# Altium project Telemetry_2.PrjPcb
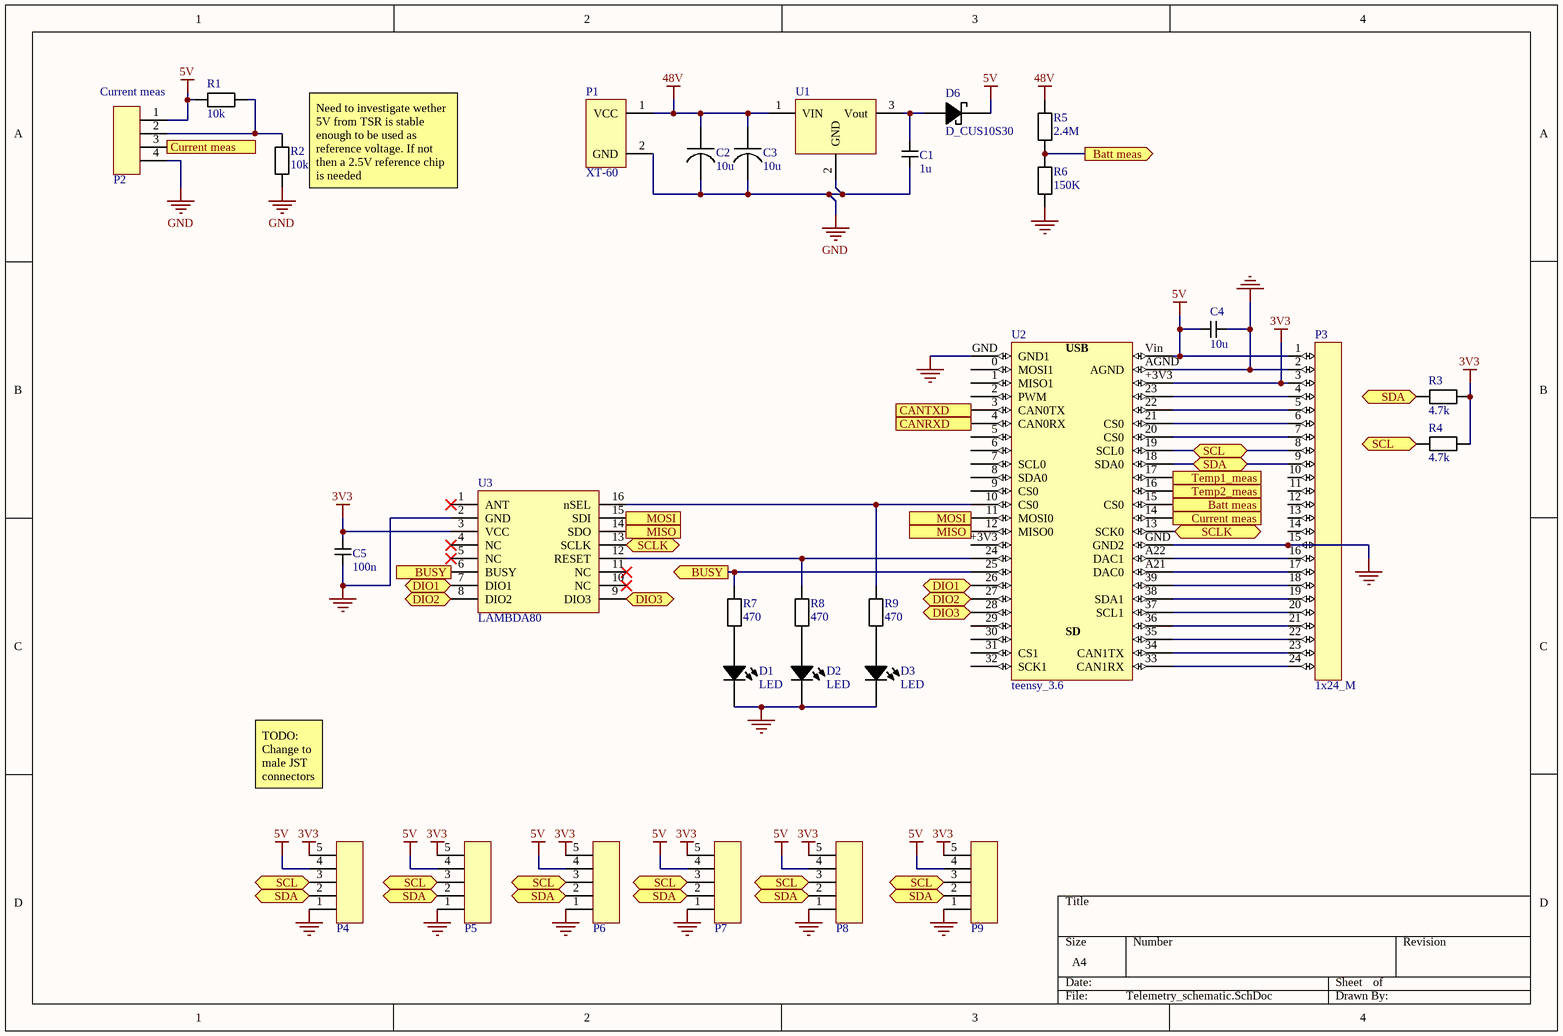
[diagram p0: Telemetry_schematic.SchDoc]
3 sheets, 55 parts. Net scope: flat (ports and power ports of the same name join across sheets).
Board file: Telemetry_PCB_2.PcbDoc
Sheets:
  Telemetry_schematic.SchDoc
  Telemetry_canbus.SchDoc
  Telemetry_temp_meas.SchDoc

## Sheet Telemetry_schematic.SchDoc: oiaejrboidr
size A4; Revision: 1.1; SheetNumber: 1; SheetTotal: 1

### Parts
C1  value 1u  [C_SMD_0805_pcb]  (hidden comment: SMD)
C2  value 10u  [C_EL_SMT_Ø6.3]  (hidden comment: C_EL_SMT_Ø6.3)
C3  value 10u  [C_EL_SMT_Ø6.3]  (hidden comment: C_EL_SMT_Ø6.3)
C4  value 10u  [C_SMD_0805_pcb]  (hidden comment: SMD)
C5  value 100n  [C_SMD_0805_pcb]  (hidden comment: SMD)
D1  LED  [D_LED_0805]
D2  LED  [D_LED_0805]
D3  LED  [D_LED_0805]
D6  D_CUS10S30  [D_SC-76]
P1  XT-60  [XT-60]
P2  JST_SE_4PIN  [JST_SE_4PIN]  (value not drawn)
P3  1x24_M  [PIN_HEADER_M_1x24]
P4  1x5_M  [PIN_HEADER_M_1x5]  (value not drawn)
P5  1x5_M  [PIN_HEADER_M_1x5]  (value not drawn)
P6  1x5_M  [PIN_HEADER_M_1x5]  (value not drawn)
P7  1x5_M  [PIN_HEADER_M_1x5]  (value not drawn)
P8  1x5_M  [PIN_HEADER_M_1x5]  (value not drawn)
P9  1x5_M  [PIN_HEADER_M_1x5]  (value not drawn)
R1  value 10k  [R_SMD_0805_pcb]  (hidden comment: SMD)
R2  value 10k  [R_SMD_0805_pcb]  (hidden comment: SMD)
R3  value 4.7k  [R_SMD_0805_pcb]  (hidden comment: SMD)
R4  value 4.7k  [R_SMD_0805_pcb]  (hidden comment: SMD)
R5  value 2.4M  [R_SMD_0805_pcb]  (hidden comment: SMD)
R6  value 150K  [R_SMD_0805_pcb]  (hidden comment: SMD)
R7  value 470  [R_SMD_0805_pcb]  (hidden comment: SMD)
R8  value 470  [R_SMD_0805_pcb]  (hidden comment: SMD)
R9  value 470  [R_SMD_0805_pcb]  (hidden comment: SMD)
U1  TSR_0.6-4850WI  [TSR_0.6-4850WI]  (value not drawn)
U2  teensy_3.6  [teensy_3.6]
U3  LAMBDA80  [LAMBDA62_SMT]

### Ports
Batt meas (in), Batt meas (out), BUSY (in), BUSY (out), CANRXD (out), CANTXD (in), Current meas (in), Current meas (out), DIO1 (bidir), DIO2 (bidir), DIO3 (bidir), MISO (in), MISO (out), MOSI (in), MOSI (out), SCL (bidir), SCLK (bidir), SDA (bidir), Temp1_meas (in), Temp2_meas (in)

### Nets
3V3: C5.1 P3.3 P4.5 P5.5 P6.5 P7.5 P8.5 P9.5 R3.1 R4.1 U2.+3V3 U3.3(VCC)
5V: C4.2 D6.2 P2.1 P3.1 P4.4 P5.4 P6.4 P7.4 P8.4 P9.4 R1.1 U2.Vin
48V: C2.2 C3.2 P1.1(VCC) R5.2 U1.1(VIN)
GND: C1.2 C2.1 C3.1 C4.1 C5.2 D1.2 D2.2 D3.2 P1.2(GND) P2.4 P3.2 P3.15 P4.1 P5.1 P6.1 P7.1 P8.1 P9.1 R2.1 R6.1 U1.2(GND) U2.AGND U2.GND(GND1) U3.2(GND)
NetC1_1: C1.1 D6.1 U1.3(Vout)
NetD1_1: D1.1 R7.1
NetD2_1: D2.1 R8.1
NetD3_1: D3.1 R9.1
NetP2_2: P2.2 R1.2 R2.2
NetP2_3: P2.3 U2.14 ; port Current meas
NetP3_4: P3.4 U2.23
NetP3_5: P3.5 U2.22
NetP3_6: P3.6 U2.21(CS0)
NetP3_7: P3.7 U2.20(CS0)
NetP3_8: P3.8 P4.3 P5.3 P6.3 P7.3 P8.3 P9.3 R4.2 U2.19(SCL0) ; port SCL
NetP3_9: P3.9 P4.2 P5.2 P6.2 P7.2 P8.2 P9.2 R3.2 U2.18(SDA0) ; port SDA
NetP3_16: P3.16 U2.A22(DAC1)
NetP3_17: P3.17 U2.A21(DAC0)
NetP3_18: P3.18 U2.39
NetP3_19: P3.19 U2.38(SDA1)
NetP3_20: P3.20 U2.37(SCL1)
NetP3_21: P3.21 U2.36
NetP3_22: P3.22 U2.35
NetP3_23: P3.23 U2.34(CAN1TX)
NetP3_24: P3.24 U2.33(CAN1RX)
NetR5_1: R5.1 R6.2 U2.15(CS0) ; port Batt meas
NetR7_2: R7.2 U2.25 U3.6(BUSY) ; port BUSY
NetR8_2: R8.2 U2.24 U3.12(RESET)
NetR9_2: R9.2 U2.10(CS0) U3.16(nSEL)
NetR12_1: U2.4(CAN0RX) ; port CANRXD
NetR13_1: U2.3(CAN0TX) ; port CANTXD
NetR16_2: U2.17 ; port Temp1_meas
NetR22_2: U2.16 ; port Temp2_meas
NetU2_11: U2.11(MOSI0) U3.15(SDI) ; port MOSI
NetU2_12: U2.12(MISO0) U3.14(SDO) ; port MISO
NetU2_13: U2.13(SCK0) U3.13(SCLK) ; port SCLK
NetU2_26: U2.26 U3.7(DIO1) ; port DIO1
NetU2_27: U2.27 U3.8(DIO2) ; port DIO2
NetU2_28: U2.28 U3.9(DIO3) ; port DIO3

Not connected (* = marked no-connect by the designer): P3 10 11 12 13 14; U2 0(MOSI1) 1(MISO1) 2(PWM) 5 6 7(SCL0) 8(SDA0) 9(CS0) 29 30 31(CS1) 32(SCK1); U3 1(ANT)* 4(NC)* 5(NC)* 10(NC)* 11(NC)*

### Notes on the sheet
- (near P2) Current meas
- (near R2) Need to investigate wether 5V from TSR is stable enough to be used as reference voltage. If not then a 2.5V reference chip is needed
- TODO: Change to male JST connectors
- (in symbol teensy_3.6) USB; SD

### Library data of the parts
C1 C4 C5 = C_SMD_0805: Supplier 1: *; Supplier Part Number 1: *
D1-D3 = D_LED_0805_SMD
D6 = D_CUS10S30: Schottky diode, 30V reverse voltage. 220mV forward drop @1A; Supplier Part Number 1: CUS10S30H3FCT-ND; Supplier Link 1: https://www.digikey.no/product-detail/en/toshiba-semiconductor-and-storage/CUS10S30H3F/CUS10S30H3FCT-ND/5114377
P3 = PIN_HEADER_M_1x24: Supplier Part Number 1: *; Supplier 1: *
P4-P9 = PIN_HEADER_M_1x5: Supplier Part Number 1: *; Supplier 1: *
R1-R9 = R_SMD_0805: Supplier 1: *; Supplier Part Number 1: *
U3 = LAMBDA_80_DIP
C2 C3 = C_EL_SMT_Ø6.3: Supplier 1: *; Supplier Part Number 1: *
P1 = XT-60: Supplier Part Number 1: *; Supplier 1: *
P2 = JST_SE_4PIN: Supplier Link 1: https://www.digikey.com/product-detail/en/jst-sales-america-inc/S4B-XH-A-LF-SN/455-2243-ND/1651041; Supplier Part Number 1: 455-2243-ND
U2 = teensy_3.6: Supplier 1: *; Supplier Part Number 1: *

## Sheet Telemetry_canbus.SchDoc: Telemetry CANbus
size A4; Organization: Altium Limited; Address1: L3, 12a Rodborough Rd; Address2: Frenchs Forest; Address3: NSW; Address4: Australia 2086; SheetNumber: 2; SheetTotal: 2
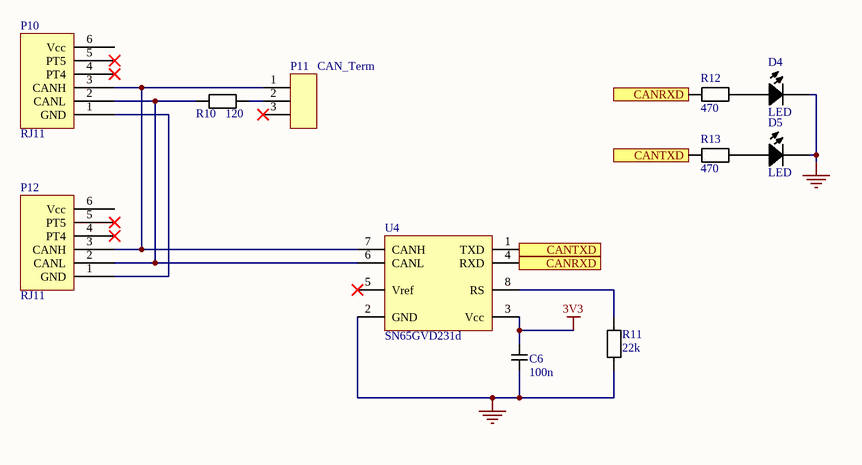
[diagram p1: Telemetry_canbus.SchDoc]

### Parts
C6  value 100n  [C_SMD_0805_pcb]  (hidden comment: SMD)
D4  LED  [D_LED_0805]
D5  LED  [D_LED_0805]
P10  RJ11  [RJ11_Connector]
P11  CAN_Term  [PIN_HEADER_M_1x3]
P12  RJ11  [RJ11_Connector]
R10  value 120  [R_SMD_0805_pcb]  (hidden comment: SMD)
R11  value 22k  [R_SMD_0805_pcb]  (hidden comment: SMD)
R12  value 470  [R_SMD_0805_pcb]  (hidden comment: SMD)
R13  value 470  [R_SMD_0805_pcb]  (hidden comment: SMD)
U4  SN65GVD231d  [SN65HVD231D_SMD]

### Ports
CANRXD, CANRXD (in), CANTXD, CANTXD (out)

### Nets
3V3: C6.1 U4.3(Vcc)
GND: C6.2 D4.2 D5.2 R11.1 U4.2(GND)
NetD4_1: D4.1 R12.2
NetD5_1: D5.1 R13.2
NetP10_1: P10.1(GND) P12.1(GND)
NetP10_2: P10.2(CANL) P12.2(CANL) R10.1 U4.6(CANL)
NetP10_3: P10.3(CANH) P11.1 P12.3(CANH) U4.7(CANH)
NetP11_2: P11.2 R10.2
NetR11_2: R11.2 U4.8(RS)
NetR12_1: R12.1 U4.4(RXD) ; port CANRXD
NetR13_1: R13.1 U4.1(TXD) ; port CANTXD

Not connected (* = marked no-connect by the designer): P10 4(PT4)* 5(PT5)* 6(Vcc); P11 3*; P12 4(PT4)* 5(PT5)* 6(Vcc); U4 5(Vref)*

### Notes on the sheet
- Title
- Size:
- Date:
- A4
- Number:
- Time:
- Revision:
- Sheet
- of
- File:

### Library data of the parts
C6 = C_SMD_0805: Supplier 1: *; Supplier Part Number 1: *
D4 D5 = D_LED_0805_SMD
P10 P12 = RJ11_Connector: Supplier Part Number 1: *; Supplier 1: *
P11 = PIN_HEADER_M_1x3
R10-R13 = R_SMD_0805: Supplier 1: *; Supplier Part Number 1: *
U4 = SN65HVD231D_SMD: Supplier 1: *; Supplier Part Number 1: *

## Sheet Telemetry_temp_meas.SchDoc: Telemetry temp meas
size A4; Author: Magnus S. Aarnes; DrawnBy: Magnus Aarnes; Organization: Altium Limited; DocumentNumber: 1; Revision: 1; SheetNumber: 2; SheetTotal: 3
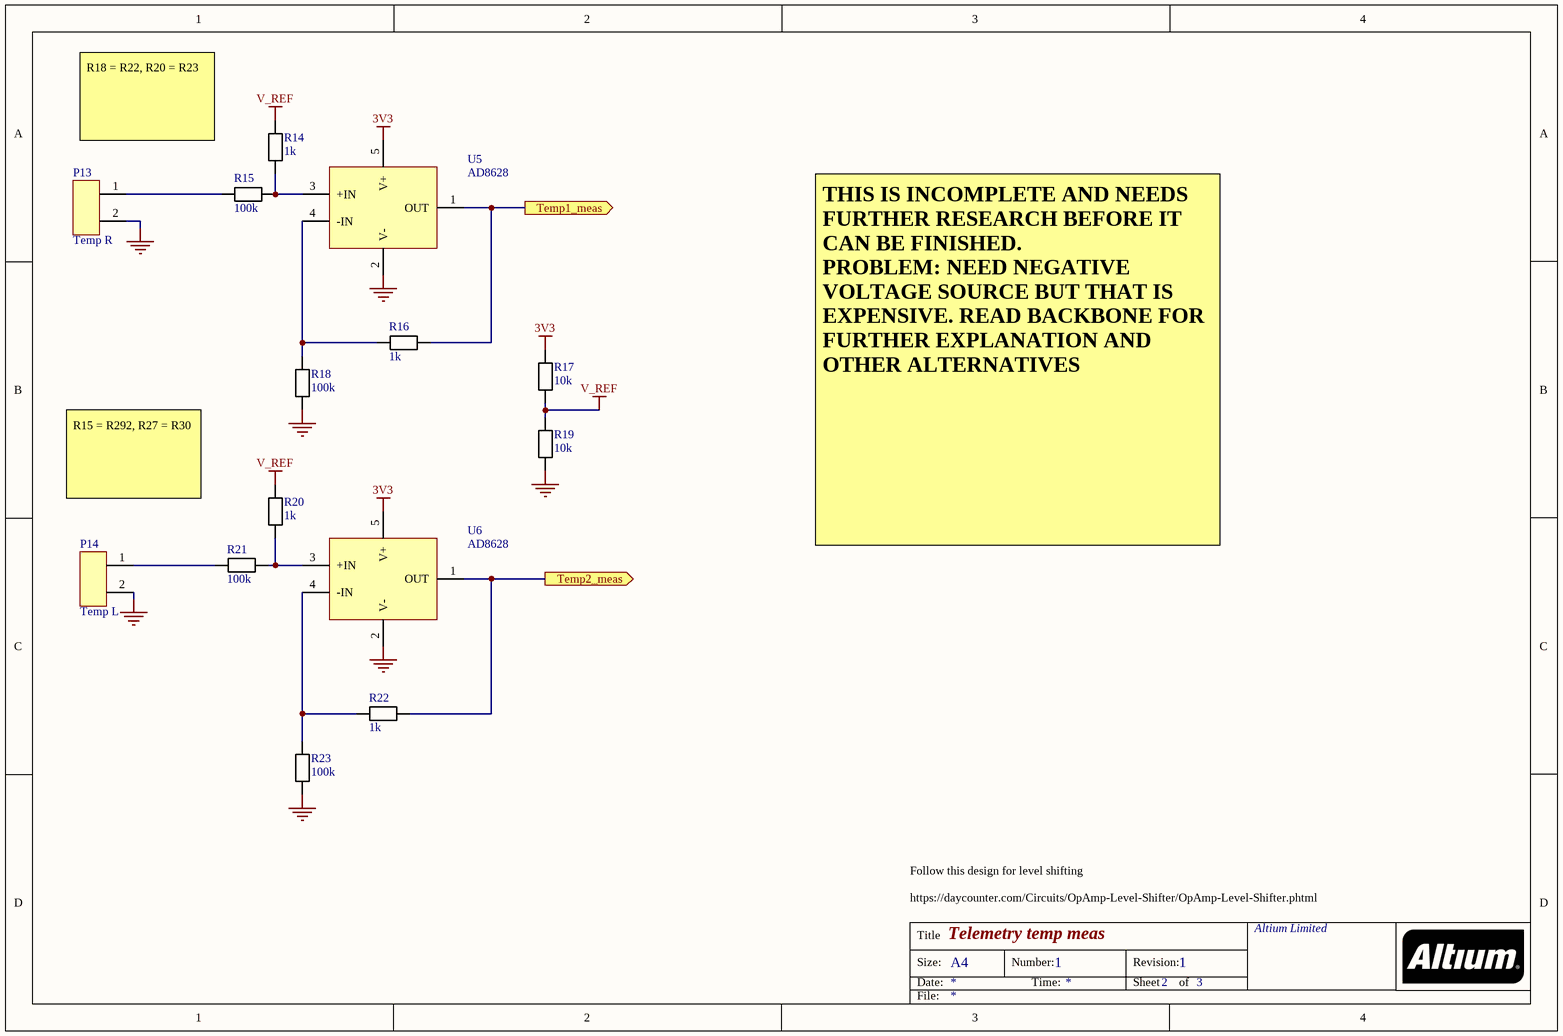
[diagram p2: Telemetry_temp_meas.SchDoc]

### Parts
P13  Temp R  [JST_SE_2PIN]
P14  Temp L  [JST_SE_2PIN]
R14  value 1k  [R_SMD_0805_pcb]  (hidden comment: SMD)
R15  value 100k  [R_SMD_0805_pcb]  (hidden comment: SMD)
R16  value 1k  [R_SMD_0805_pcb]  (hidden comment: SMD)
R17  value 10k  [R_SMD_0805_pcb]  (hidden comment: SMD)
R18  value 100k  [R_SMD_0805_pcb]  (hidden comment: SMD)
R19  value 10k  [R_SMD_0805_pcb]  (hidden comment: SMD)
R20  value 1k  [R_SMD_0805_pcb]  (hidden comment: SMD)
R21  value 100k  [R_SMD_0805_pcb]  (hidden comment: SMD)
R22  value 1k  [R_SMD_0805_pcb]  (hidden comment: SMD)
R23  value 100k  [R_SMD_0805_pcb]  (hidden comment: SMD)
U5  AD8628  [SOT-23-5]
U6  AD8628  [SOT-23-5]

### Ports
Temp1_meas (out), Temp2_meas (out)

### Nets
3V3: R17.2 U5.5(V+) U6.5(V+)
GND: P13.2 P14.2 R18.1 R19.1 R23.2 U5.2(V-) U6.2(V-)
V_REF: R14.2 R17.1 R19.2 R20.2
NetP13_1: P13.1 R15.1
NetP14_1: P14.1 R21.1
NetR14_1: R14.1 R15.2 U5.3(+IN)
NetR16_1: R16.1 R18.2 U5.4(-IN)
NetR16_2: R16.2 U5.1(OUT) ; port Temp1_meas
NetR20_1: R20.1 R21.2 U6.3(+IN)
NetR22_1: R22.1 R23.1 U6.4(-IN)
NetR22_2: R22.2 U6.1(OUT) ; port Temp2_meas

### Notes on the sheet
- R18 = R22, R20 = R23
- R15 = R292, R27 = R30
- THIS IS INCOMPLETE AND NEEDS FURTHER RESEARCH BEFORE IT CAN BE FINISHED.
  PROBLEM: NEED NEGATIVE VOLTAGE SOURCE BUT THAT IS EXPENSIVE. READ BACKBONE FOR FURTHER EXPLANATION AND OTHER ALTERNATIVES
- Follow this design for level shifting
  https://daycounter.com/Circuits/OpAmp-Level-Shifter/OpAmp-Level-Shifter.phtml
- Title
- Size:
- Date:
- A4
- Number:
- Time:
- Revision:
- Sheet
- of
- File:

### Library data of the parts
P13 P14 = JST_SE_2PIN: Supplier 1: *; Supplier Part Number 1: *
R14-R23 = R_SMD_0805: Supplier 1: *; Supplier Part Number 1: *
U5 U6 = AD8628WAUJZ-R7_SOT-23-5: Supplier Part Number 1: AD8628WAUJZ-R7CT-ND; Supplier Link 1: https://www.digikey.com/product-detail/en/analog-devices-inc/AD8628WAUJZ-R7/AD8628WAUJZ-R7CT-ND/2467896

## Nets that join several sheets
3V3: Telemetry_schematic (12 pins), Telemetry_canbus (C6.1 U4.3), Telemetry_temp_meas (R17.2 U5.5 U6.5)
GND: Telemetry_schematic (24 pins), Telemetry_canbus (5 pins), Telemetry_temp_meas (7 pins)
NetR12_1: Telemetry_schematic (U2.4), Telemetry_canbus (R12.1 U4.4)
NetR13_1: Telemetry_schematic (U2.3), Telemetry_canbus (R13.1 U4.1)
NetR16_2: Telemetry_schematic (U2.17), Telemetry_temp_meas (R16.2 U5.1)
NetR22_2: Telemetry_schematic (U2.16), Telemetry_temp_meas (R22.2 U6.1)